# Altium schematic sheet MiniRover.SchDoc
size A3
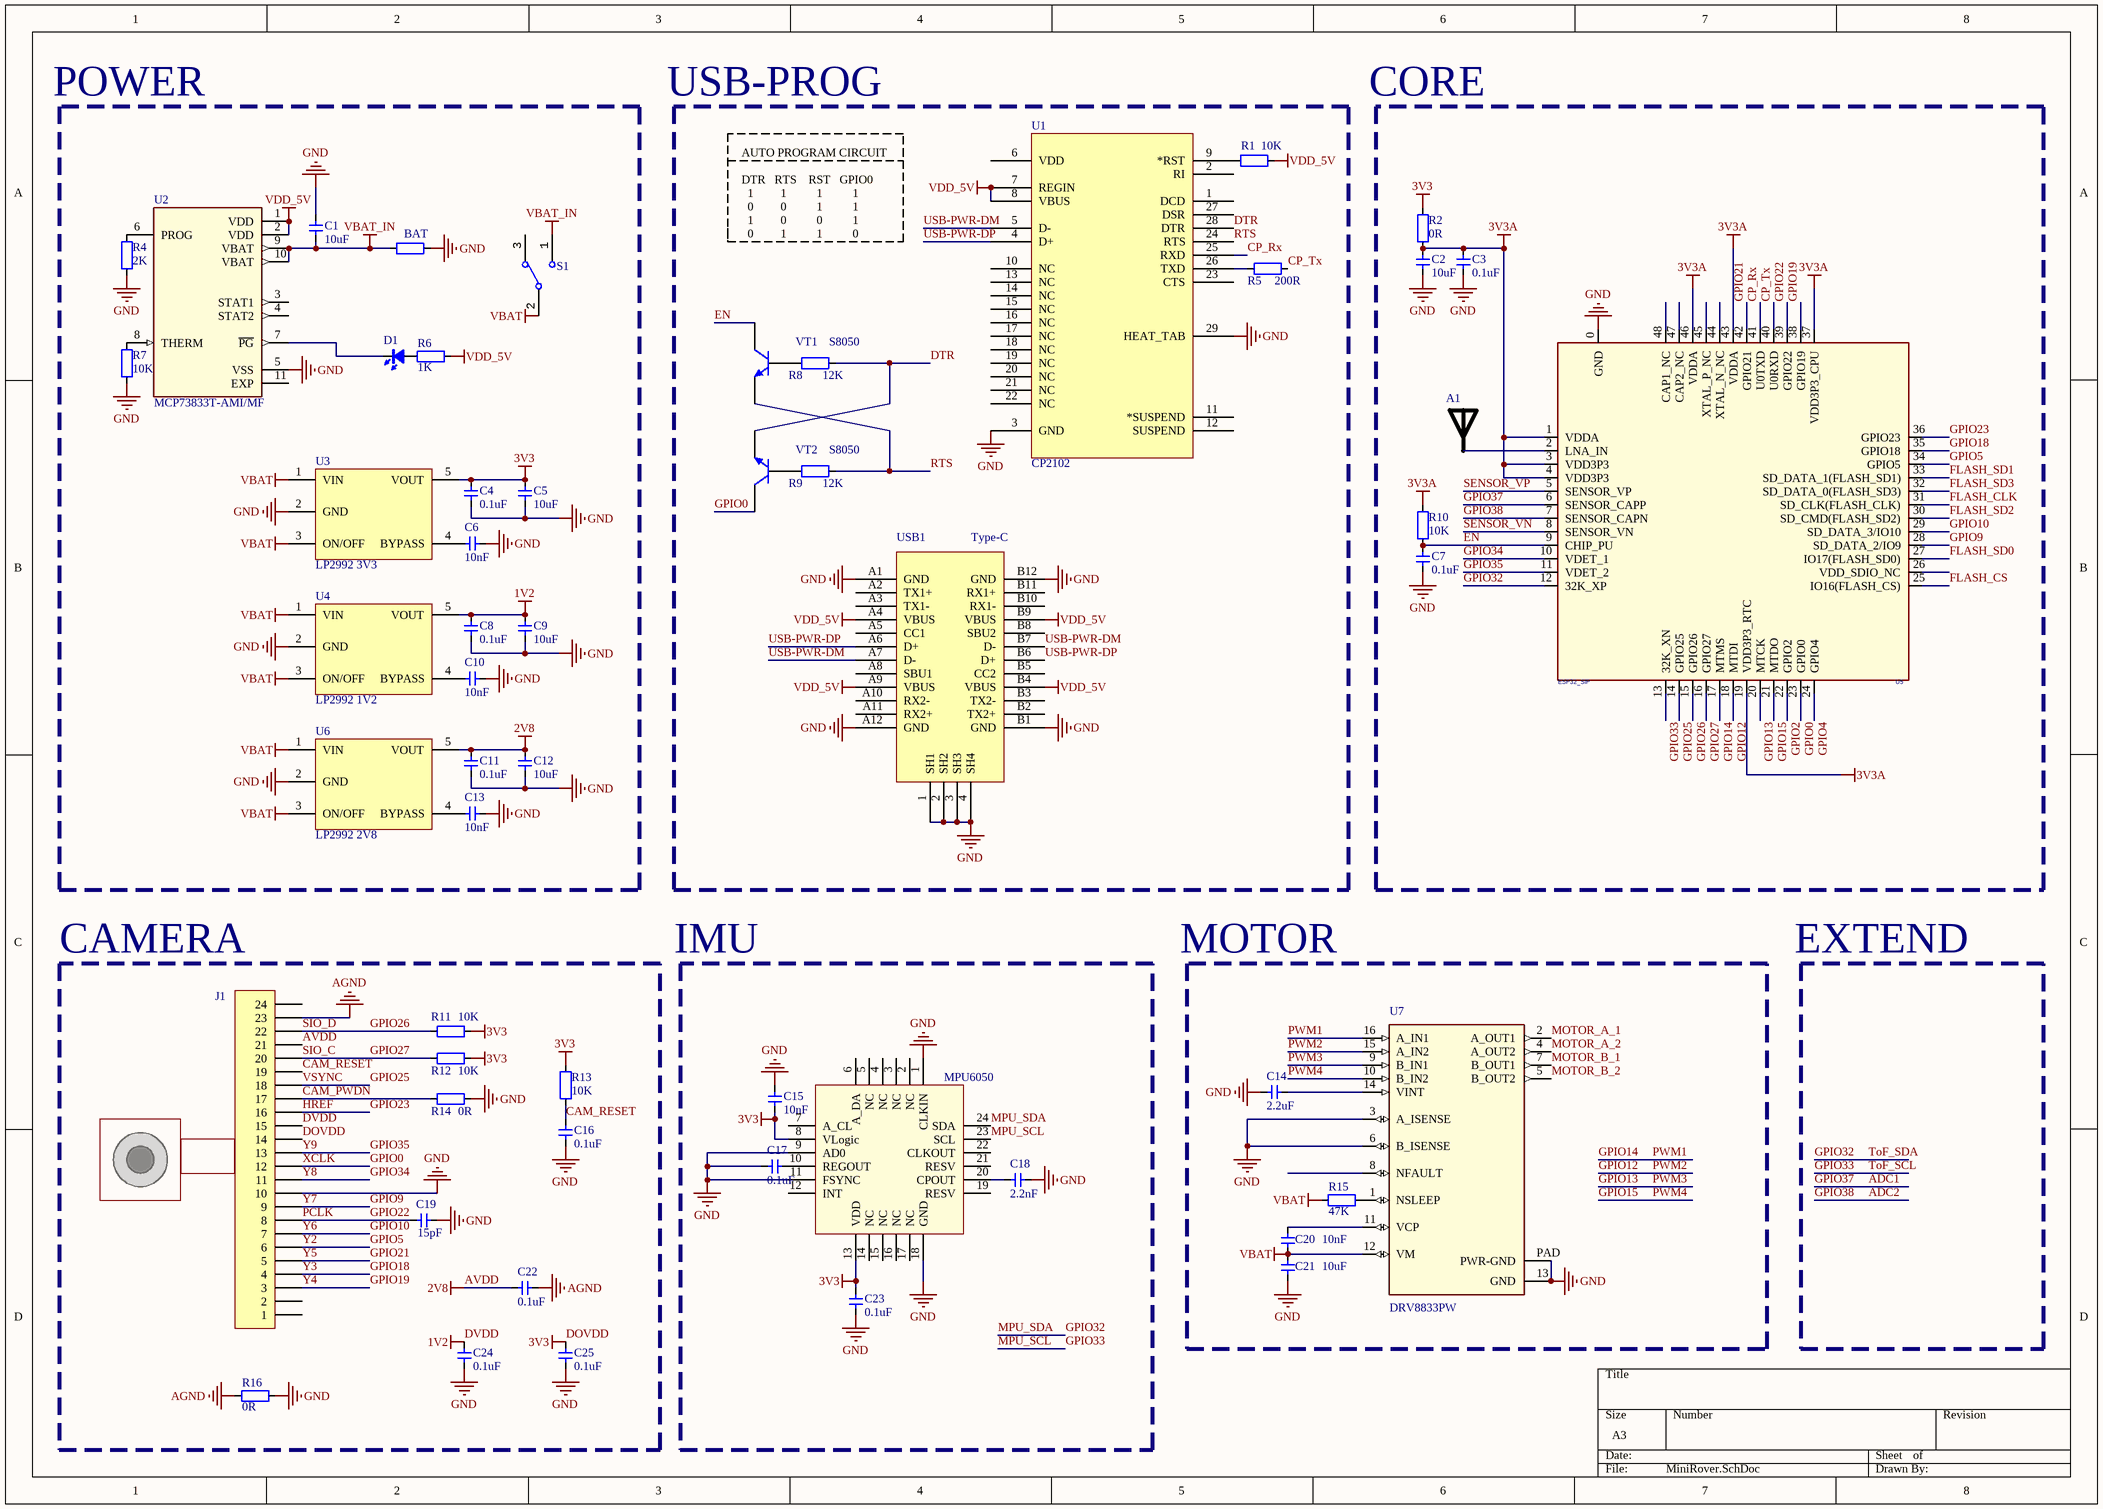
[diagram p0: MiniRover.SchDoc]

## Parts
A1  RAINSUN  [ANT-Rainsun-AN5120]  (value not drawn)
C1  10uF  [0603-CAP]
C2  10uF  [0603-CAP]
C3  0.1uF  [CAP_0402]
C4  0.1uF  [CAP_0402]
C5  10uF  [0603-CAP]
C6  10nF  [CAP_0402]
C7  0.1uF  [CAP_0402]
C8  0.1uF  [CAP_0402]
C9  10uF  [0603-CAP]
C10  10nF  [CAP_0402]
C11  0.1uF  [CAP_0402]
C12  10uF  [0603-CAP]
C13  10nF  [CAP_0402]
C14  2.2uF  [CAP_0402]
C15  10nF  [CAP_0402]
C16  0.1uF  [CAP_0402]
C17  0.1uF  [CAP_0402]
C18  2.2nF  [CAP_0402]
C19  15pF  [CAP_0402]
C20  10nF  [CAP_0402]
C21  10uF  [CAP_0402]
C22  0.1uF  [CAP_0402]
C23  0.1uF  [CAP_0402]
C24  0.1uF  [CAP_0402]
C25  0.1uF  [CAP_0402]
D1  color?  [LED_0402_RED]  (value not drawn)
J1  0.5S_A_24PWB  [FPC-24P]  (value not drawn)
R1  10K  [RES_0402]
R2  0R  [RES_0402]
R3  BAT  [0805-L]
R4  2K  [RES_0402]
R5  200R  [RES_0402]
R6  1K  [RES_0402]
R7  10K  [RES_0402]
R8  12K  [RES_0402]
R9  12K  [RES_0402]
R10  10K  [RES_0402]
R11  10K  [RES_0402]
R12  10K  [RES_0402]
R13  10K  [RES_0402]
R14  0R  [RES_0402]
R15  47K  [RES_0402]
R16  0R  [RES_0402]
S1  SPDT 3P  [SwitchSPDT_2.8X6.6_90]  (value not drawn)
U1  CP2102  [QFN-28]
U2  MCP73833T-AMI/MF  [QFN-10]
U3  LP2992 3V3  [SOT23-5]
U4  LP2992 1V2  [SOT23-5]
U5  ESP32_SIP  [QFN-48_7X7]
U6  LP2992 2V8  [SOT23-5]
U7  DRV8833PW  [TSSOP-16]
U8  MPU6050  [QFN-24]
USB1  Type-C  [Type-C-TOP]
VT1  S8050  [SMT_TRIODE_NPN]
VT2  S8050  [SMT_TRIODE_NPN]

## Blocks framed on the sheet
CAMERA: C16 C19 C22 C24 C25 J1 R11-R14 R16

## Nets
3V3A: C2.2 C3.2 R2.2 R10.1 U5.1(VDDA) U5.3(VDD3P3) U5.4(VDD3P3) U5.19(VDD3P3_RTC) U5.37(VDD3P3_CPU) U5.43(VDDA) U5.46(VDDA)
AGND: C22.1 J1.23 R16.1
AVDD: C11.2 C12.2 C22.2 J1.21 U6.5(VOUT)  [also labelled 2V8]
DOVDD: C4.2 C5.2 C15.1 C23.2 C25.2 J1.14 R2.1 R11.2 R12.2 R13.2 U3.5(VOUT) U8.8(VLogic) U8.13(VDD)  [also labelled 3V3]
DVDD: C8.2 C9.2 C24.2 J1.15 U4.5(VOUT)  [also labelled 1V2]
GND: C1.2 C2.1 C3.1 C4.1 C5.1 C6.1 C7.2 C8.1 C9.1 C10.1 C11.1 C12.1 C13.1 C14.1 C15.2 C16.1 C17.2 C18.1 C19.2 C21.1 C23.1 C24.1 C25.1 J1.10 R3.2 R4.1 R7.1 R14.2 R16.2 U1.3(GND) U1.29(HEAT_TAB) U2.5(VSS) U3.2(GND) U4.2(GND) U5.0(GND) U6.2(GND) U7.3(A_ISENSE) U7.6(B_ISENSE) U7.13(GND) U7.PAD(PWR-GND) U8.1(CLKIN) U8.9(AD0) U8.11(FSYNC) U8.18(GND) USB1.1(SH1) USB1.2(SH2) USB1.3(SH3) USB1.4(SH4) USB1.A1(GND) USB1.A12(GND) USB1.B1(GND) USB1.B12(GND)
VBAT: C20.1 C21.2 R15.2 S1.2 U3.1(VIN) U3.3(ON/OFF) U4.1(VIN) U4.3(ON/OFF) U6.1(VIN) U6.3(ON/OFF) U7.12(VM)
VBAT_IN: C1.1 R3.1 S1.1 U2.9(VBAT) U2.10(VBAT)
VDD_5V: R1.1 R6.1 U1.7(REGIN) U1.8(VBUS) U2.1(VDD) U2.2(VDD) USB1.A4(VBUS) USB1.A9(VBUS) USB1.B4(VBUS) USB1.B9(VBUS)
ADC1: U5.6(SENSOR_CAPP)  [also labelled GPIO37]
ADC2: U5.7(SENSOR_CAPN)  [also labelled GPIO38]
CAM_PWDN: J1.17 R14.1
CAM_RESET: C16.2 J1.19 R13.1
CP_Rx: U1.25(RXD) U5.41(U0TXD)
CP_Tx: R5.1 U5.40(U0RXD)
DTR: R8.1 U1.28(DTR) VT2.2(E)
EN: C7.1 R10.2 U5.9(CHIP_PU) VT1.3(C)
FLASH_CLK: U5.31(SD_CLK(FLASH_CLK))
FLASH_CS: U5.25(IO16(FLASH_CS))
FLASH_SD0: U5.27(IO17(FLASH_SD0))
FLASH_SD1: U5.33(SD_DATA_1(FLASH_SD1))
FLASH_SD2: U5.30(SD_CMD(FLASH_SD2))
FLASH_SD3: U5.32(SD_DATA_0(FLASH_SD3))
GPIO0: J1.12 U5.23(GPIO0) VT2.3(C)  [also labelled XCLK]
GPIO2: U5.22(GPIO2)
GPIO4: U5.24(GPIO4)
GPIO5: J1.6 U5.34(GPIO5)  [also labelled Y2]
GPIO9: J1.9 U5.28(SD_DATA_2/IO9)  [also labelled Y7]
GPIO10: J1.7 U5.29(SD_DATA_3/IO10)  [also labelled Y6]
GPIO12: U5.18(MTDI) U7.15(A_IN2)  [also labelled PWM2]
GPIO13: U5.20(MTCK) U7.9(B_IN1)  [also labelled PWM3]
GPIO14: U5.17(MTMS) U7.16(A_IN1)  [also labelled PWM1]
GPIO15: U5.21(MTDO) U7.10(B_IN2)  [also labelled PWM4]
GPIO18: J1.4 U5.35(GPIO18)  [also labelled Y3]
GPIO19: J1.3 U5.38(GPIO19)  [also labelled Y4]
GPIO21: J1.5 U5.42(GPIO21)  [also labelled Y5]
GPIO22: C19.1 J1.8 U5.39(GPIO22)  [also labelled PCLK]
GPIO23: J1.16 U5.36(GPIO23)  [also labelled HREF]
GPIO25: J1.18 U5.14(GPIO25)  [also labelled VSYNC]
GPIO26: J1.22 R11.1 U5.15(GPIO26)  [also labelled SIO_D]
GPIO27: J1.20 R12.1 U5.16(GPIO27)  [also labelled SIO_C]
GPIO32: U5.12(32K_XP) U8.24(SDA)  [also labelled MPU_SDA, ToF_SDA]
GPIO33: U5.13(32K_XN) U8.23(SCL)  [also labelled MPU_SCL, ToF_SCL]
GPIO34: J1.11 U5.10(VDET_1)  [also labelled Y8]
GPIO35: J1.13 U5.11(VDET_2)  [also labelled Y9]
MOTOR_A_1: U7.2(A_OUT1)
MOTOR_A_2: U7.4(A_OUT2)
MOTOR_B_1: U7.7(B_OUT1)
MOTOR_B_2: U7.5(B_OUT2)
RTS: R9.1 U1.24(RTS) VT1.2(E)
SENSOR_VN: U5.8(SENSOR_VN)
SENSOR_VP: U5.5(SENSOR_VP)
USB-PWR-DM: U1.5(D-) USB1.A7(D-) USB1.B7(D-)
USB-PWR-DP: U1.4(D+) USB1.A6(D+) USB1.B6(D+)
NetA1_1: A1.1 U5.2(LNA_IN)
NetC6_2: C6.2 U3.4(BYPASS)
NetC10_2: C10.2 U4.4(BYPASS)
NetC13_2: C13.2 U6.4(BYPASS)
NetC14_2: C14.2 U7.14(VINT)
NetC17_1: C17.1 U8.10(REGOUT)
NetC18_2: C18.2 U8.20(CPOUT)
NetC20_2: C20.2 U7.11(VCP)
NetD1_1: D1.1(A) R6.2
NetD1_2: D1.2(K) U2.7(~{PG})
NetR1_2: R1.2 U1.9(*RST)
NetR4_2: R4.2 U2.6(PROG)
NetR5_2: R5.2 U1.26(TXD)
NetR7_2: R7.2 U2.8(THERM)
NetR8_2: R8.2 VT1.1(B)
NetR9_2: R9.2 VT2.1(B)
NetR15_1: R15.1 U7.1(NSLEEP)

Not connected (* = marked no-connect by the designer): J1 1 2 24; S1 3; U1 1(DCD) 2(RI) 6(VDD) 10(NC) 11(*SUSPEND) 12(SUSPEND) 13(NC) 14(NC) 15(NC) 16(NC) 17(NC) 18(NC) 19(NC) 20(NC) 21(NC) 22(NC) 23(CTS) 27(DSR); U2 3(STAT1) 4(STAT2) 11(EXP); U5 26(VDD_SDIO_NC) 44(XTAL_N_NC) 45(XTAL_P_NC) 47(CAP2_NC) 48(CAP1_NC); U7 8(NFAULT); U8 2(NC) 3(NC) 4(NC) 5(NC) 6(A_DA) 7(A_CL) 12(INT) 14(NC) 15(NC) 16(NC) 17(NC) 19(RESV) 21(RESV) 22(CLKOUT); USB1 A2(TX1+) A3(TX1-) A5(CC1) A8(SBU1) A10(RX2-) A11(RX2+) B2(TX2+) B3(TX2-) B5(CC2) B8(SBU2) B10(RX1-) B11(RX1+)

## Notes on the sheet
- POWER
- USB-PROG
- CORE
- AUTO PROGRAM CIRCUIT
  DTR   RTS    RST   GPIO0
  1         1          1          1
  0         0          1          1
  1         0          0          1
  0         1          1          0
- IMU
- MOTOR
- EXTEND

## Library data of the parts
A1 = ANT-Rainsun-AP5120
C1 C2 C5 C9 C12 = 电容-0603: Capacitor; Value: 0.1u
C3 C4 C6-C8 C10 C11 C13-C25 = 电容-0402: Capacitor; Value: 0.1u
D1 = LED_0402: LED; Type: 0402; Value: color?
J1 = OV2640: Header, 24-Pin; LatestRevisionDate: 17-Jul-2002; LatestRevisionNote: Re-released for DXP Platform.; Publisher: Altium Limited
R1 R2 R4-R16 = 电阻-0402: Resistor; Value: 22R
R3 = 电阻-0805: Resistor; Value: 22R
S1 = SwitchSPDT_2.8x6.6_90: Switch; Value: SPDT 3P; Type: SPDT
U1 = CP2102: USB转TTL; PART DESC: SINGLE-CHIP USB TO UART BRIDGE, QFN28, RoHS.; MFG #1: SILICON LABS; PART NUMBER: CP2102; Value: Value; RefDes: RefDes; Type: DEV
U2 = MCP73833T: Linear Charge Management Controller Li-Ion/Li-Pol 1mA 4.2V/4.35V/4.4V/4.5V 10-Pin DFN EP T/R; MF: Microchip; Availability: Unavailable; Package: DFN-10 Microchip; Price: None; SnapEDA_Link: https://www.snapeda.com/parts/MCP73833T-AMI/MF/Microchip/view-part/?ref=snap; MP: MCP73833T-AMI/MF; Value: *
U3 U4 U6 = LP2992: LDO
U5 = ESP32-PICO
U8 = MPU6050: 六轴传感器
USB1 = USB-Type-C-TOP
VT1 VT2 = SMT_TRIODE_NPN: Surface mount NPN transistor, package SOT-23
U7 = DRV8833PW: SnapEDA_Link: https://www.snapeda.com/parts/DRV8833PW/Texas%20Instruments/view-part/507725/?ref=snap; Value: *